# EasyEDA Pro project ProProject_powerboard_ssl_philipp_2023-09-25.epro, schematic Schematic4
Create Date: 2023-04-19; Page Name: P1; Project Name: powerboard_ssl_philipp; Schematic Name: Schematic4; Update Date: 2023-04-19; Company: 嘉立创EDA; Page Size: A4; Version: V1.0
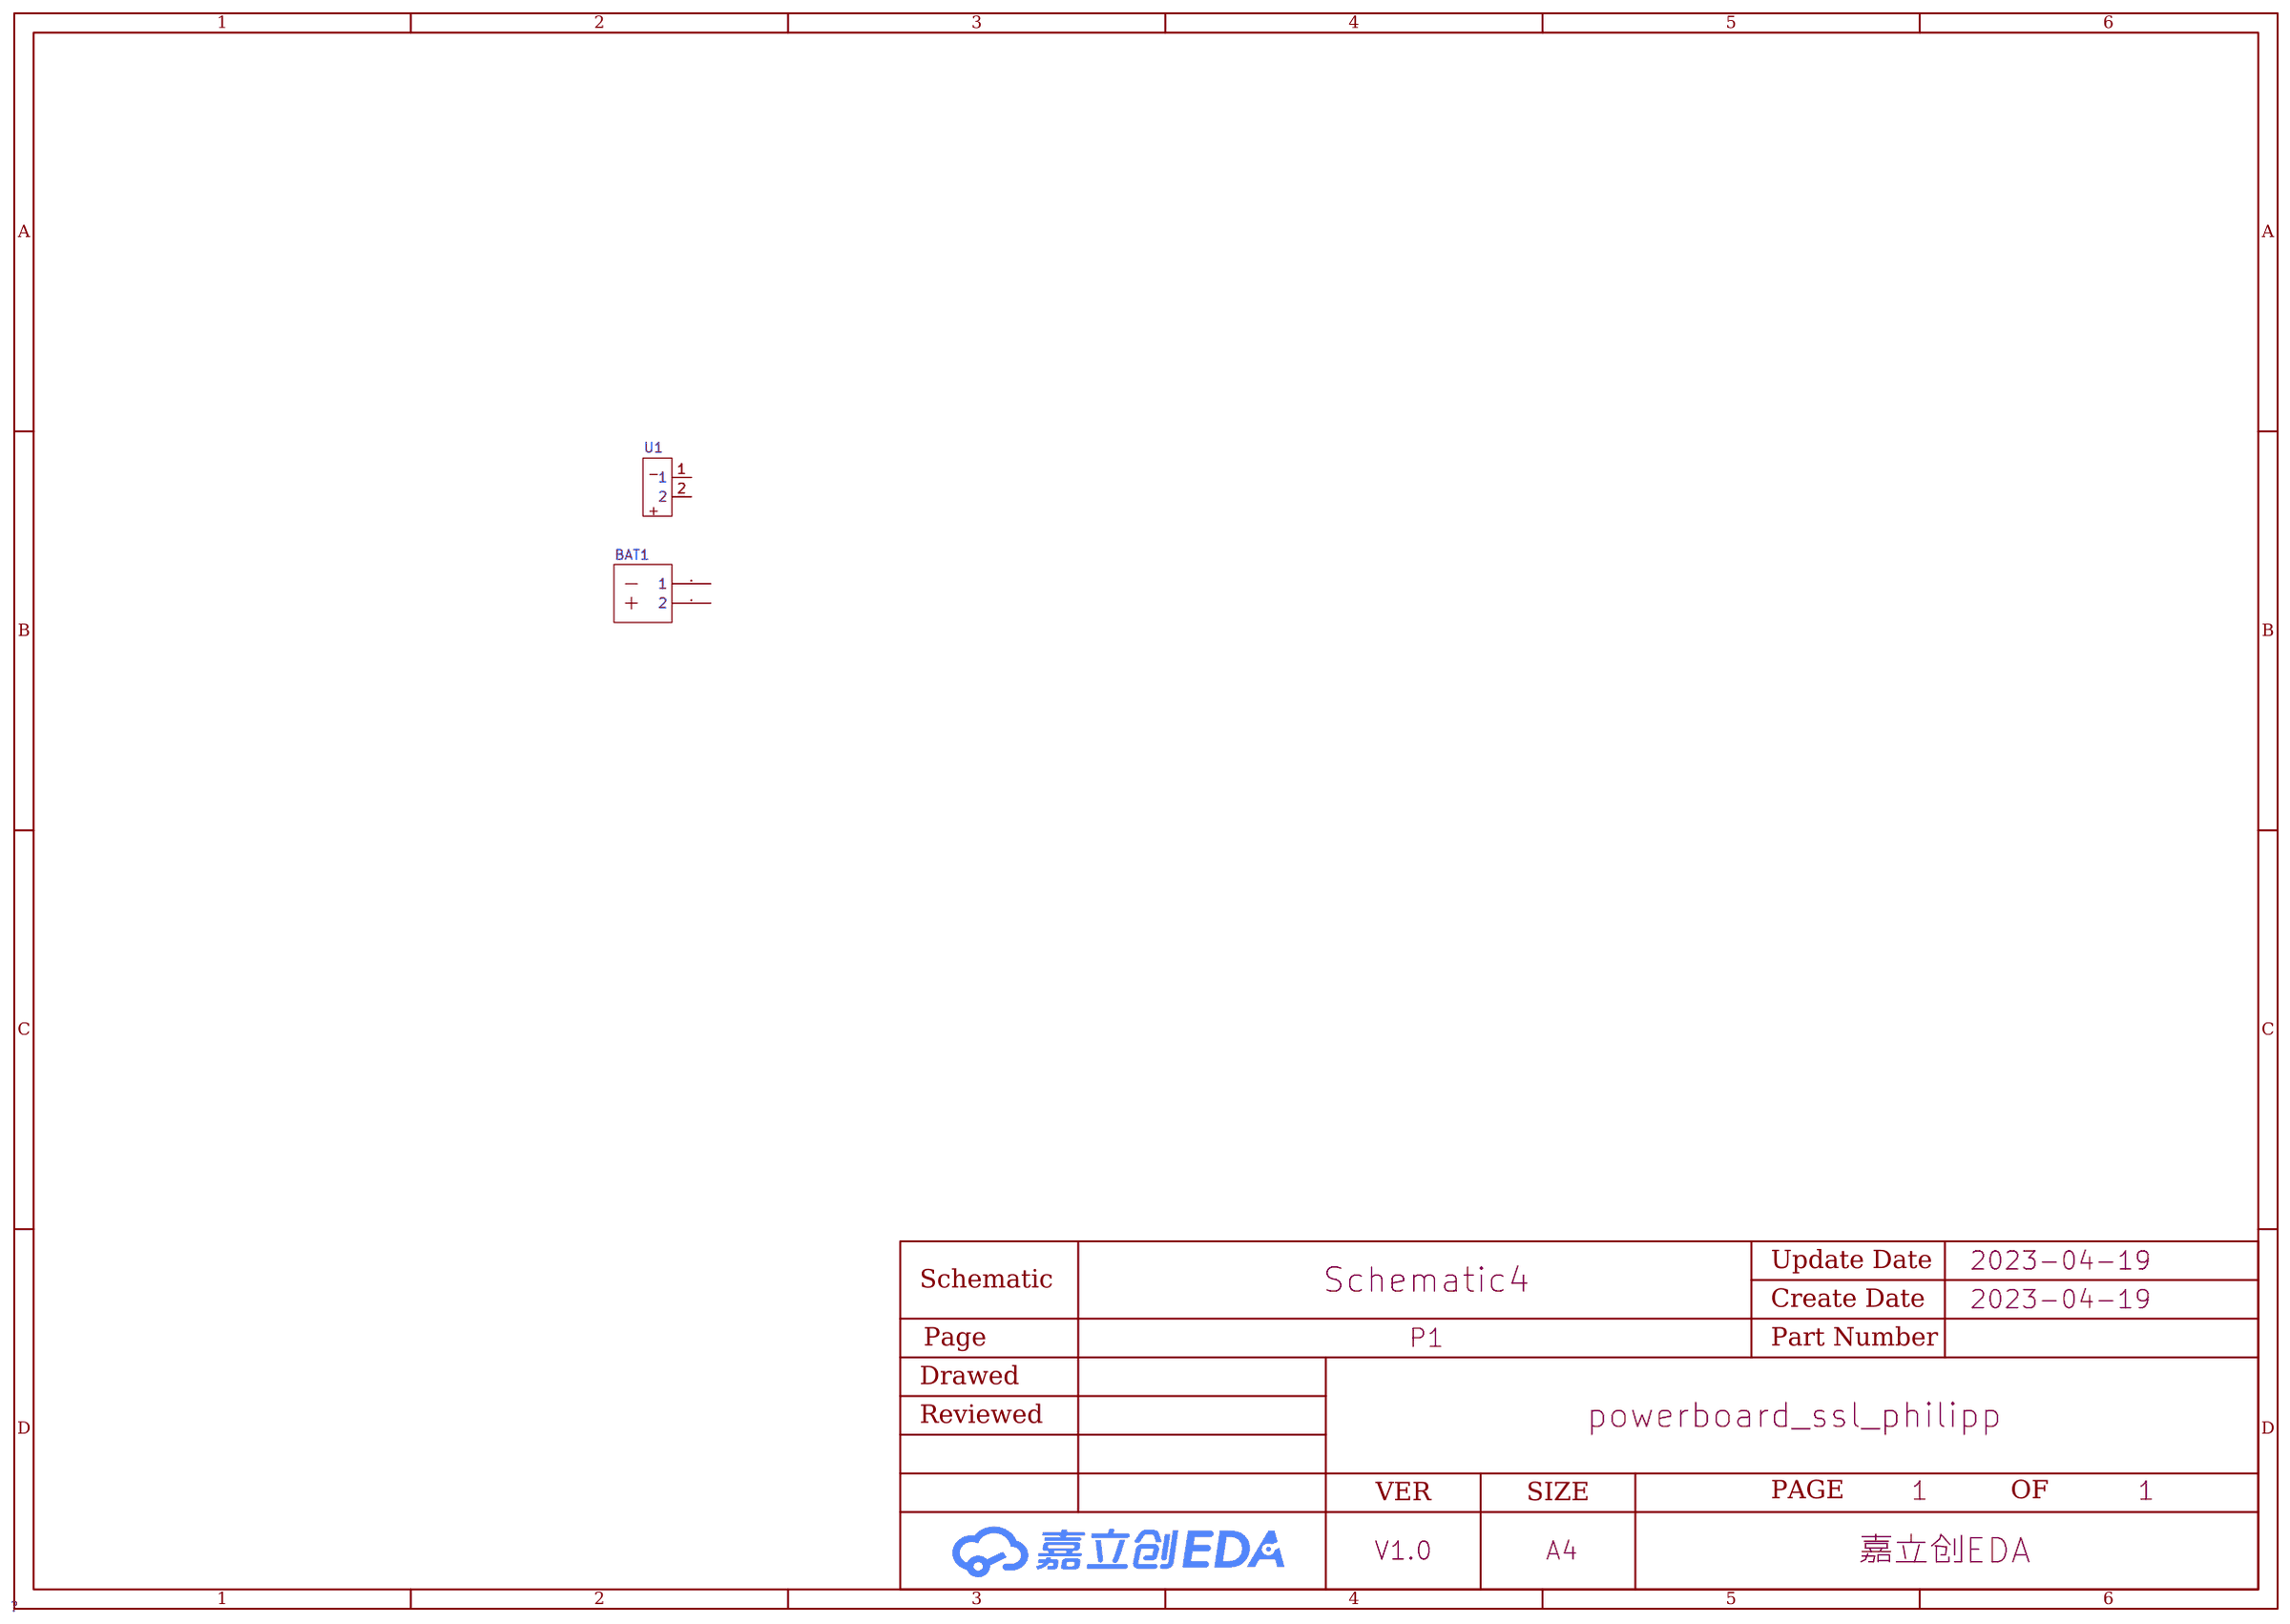
[diagram p18: schematic sheet]

## Parts
BAT1  -  [BT2.0]
U1  -  [BT2.0]

## Library data of the parts
BAT1 = BT2.0: Pin Type: IN
U1 = bt2.0 立式: Pin Type: IN

## Nets

Not connected (* = marked no-connect by the designer): BAT1 1 2; U1 1 2
